# Altium project LimeSDR-QPCIe_1v2.PrjPcb (part 12 of 13)

## Sheet 28_BoardPowerSupply 2.SchDoc: Board power supply 2
size A4; Organization: Lime Microsystems; Address1: Surrey Tech Centre; Address2: Guildford GU2 7YG; Address3: Surrey; Address4: United Kingdom; Revision: v1.2; SheetNumber: 26; SheetTotal: 27
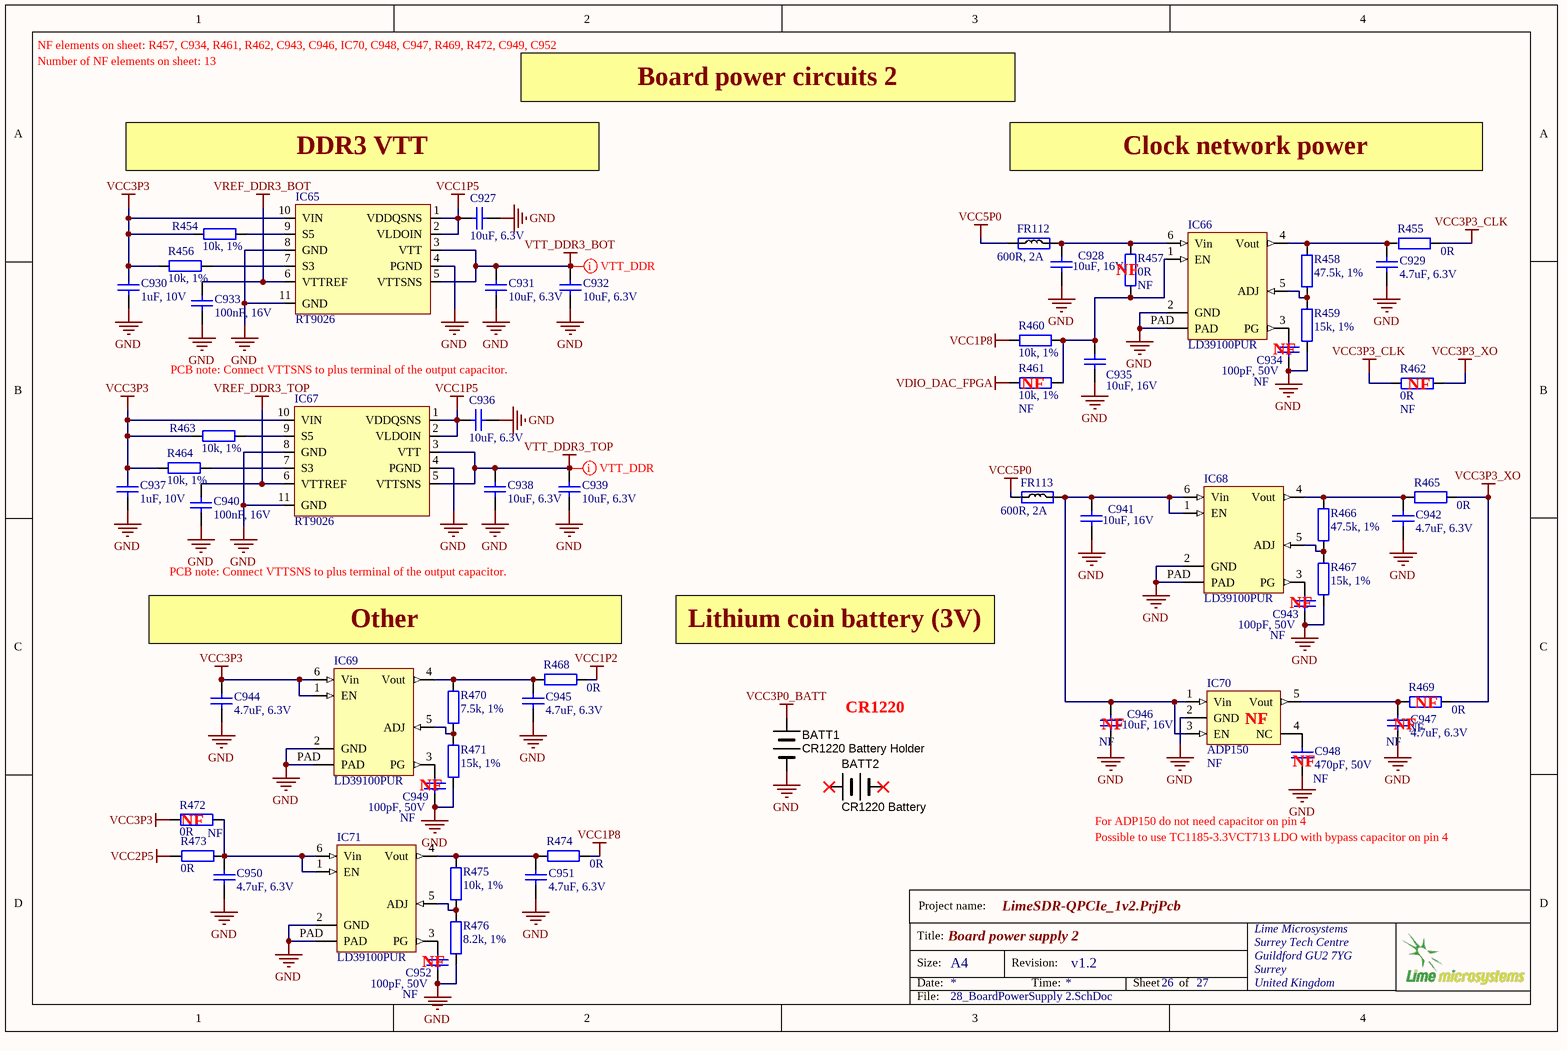
[diagram p27: 28_BoardPowerSupply 2.SchDoc]

### Parts
BATT1  CR1220 Battery Holder  [CR1220_SMD_holder]
BATT2  CR1220 Battery  (mechanical)
C927  10uF, 6.3V  [CAP0603]
C928  10uF, 16V  [CAP0603]
C929  4.7uF, 6.3V  [CAP0402]
C930  1uF, 10V  [CAP0402]
C931  10uF, 6.3V  [CAP0603]
C932  10uF, 6.3V  [CAP0603]
C933  100nF, 16V  [CAP0402]
C934  100pF, 50V  Assembly Info: NF  [CAP0402]
C935  10uF, 16V  [CAP0603]
C936  10uF, 6.3V  [CAP0603]
C937  1uF, 10V  [CAP0402]
C938  10uF, 6.3V  [CAP0603]
C939  10uF, 6.3V  [CAP0603]
C940  100nF, 16V  [CAP0402]
C941  10uF, 16V  [CAP0603]
C942  4.7uF, 6.3V  [CAP0402]
C943  100pF, 50V  Assembly Info: NF  [CAP0402]
C944  4.7uF, 6.3V  [CAP0402]
C945  4.7uF, 6.3V  [CAP0402]
C946  10uF, 16V  Assembly Info: NF  [CAP0603]
C947  4.7uF, 6.3V  Assembly Info: NF  [CAP0402]
C948  470pF, 50V  Assembly Info: NF  [CAP0402]
C949  100pF, 50V  Assembly Info: NF  [CAP0402]
C950  4.7uF, 6.3V  [CAP0402]
C951  4.7uF, 6.3V  [CAP0402]
C952  100pF, 50V  Assembly Info: NF  [CAP0402]
FR112  600R, 2A  [RES0805]
FR113  600R, 2A  [RES0805]
IC65  RT9026  [MSOP10]
IC66  LD39100PUR  [LD39100PUR]
IC67  RT9026  [MSOP10]
IC68  LD39100PUR  [LD39100PUR]
IC69  LD39100PUR  [LD39100PUR]
IC70  ADP150  Assembly Info: NF  [SOT23-5]
IC71  LD39100PUR  [LD39100PUR]
R454  10k, 1%  [RES0402]
R455  0R  [RES0402]
R456  10k, 1%  [RES0402]
R457  0R  Assembly Info: NF  [RES0805]
R458  47.5k, 1%  [RES0402]
R459  15k, 1%  [RES0402]
R460  10k, 1%  [RES0402]
R461  10k, 1%  Assembly Info: NF  [RES0402]
R462  0R  Assembly Info: NF  [RES0805]
R463  10k, 1%  [RES0402]
R464  10k, 1%  [RES0402]
R465  0R  [RES0402]
R466  47.5k, 1%  [RES0402]
R467  15k, 1%  [RES0402]
R468  0R  [RES0402]
R469  0R  Assembly Info: NF  [RES0402]
R470  7.5k, 1%  [RES0402]
R471  15k, 1%  [RES0402]
R472  0R  Assembly Info: NF  [RES0805]
R473  0R  [RES0402]
R474  0R  [RES0402]
R475  10k, 1%  [RES0402]
R476  8.2k, 1%  [RES0402]

### Nets
GND: BATT1.NEGATIVE C927.1 C928.1 C929.1 C930.1 C931.1 C932.1 C933.2 C934.1 C935.1 C936.1 C937.1 C938.1 C939.1 C940.2 C941.1 C942.1 C943.1 C944.1 C945.1 C946.1 C947.1 C948.2 C949.1 C950.1 C951.1 C952.1 IC65.4(PGND) IC65.8(GND) IC65.11(GND) IC66.2(GND) IC66.PAD IC67.4(PGND) IC67.8(GND) IC67.11(GND) IC68.2(GND) IC68.PAD IC69.2(GND) IC69.PAD IC70.2(GND) IC71.2(GND) IC71.PAD R459.1 R467.1 R471.1 R476.1
VCC1P2: R468.1
VCC1P5: C927.2 C936.2 IC65.1(VDDQSNS) IC65.2(VLDOIN) IC67.1(VDDQSNS) IC67.2(VLDOIN)
VCC1P8: R460.1 R474.1
VCC2P5: R473.2
VCC3P0_BATT: BATT1.POSITIVE
VCC3P3: C930.2 C937.2 C944.2 IC65.10(VIN) IC67.10(VIN) IC69.1(EN) IC69.6(Vin) R454.1 R456.1 R463.1 R464.1 R472.2
VCC3P3_CLK: R455.1 R462.1
VCC3P3_XO: R462.2 R465.1 R469.1
VCC5P0: FR112.1 FR113.1
VDIO_DAC_FPGA: R461.1
VREF_DDR3_BOT: C933.1 IC65.6(VTTREF)
VREF_DDR3_TOP: C940.1 IC67.6(VTTREF)
VTT_DDR3_BOT: C931.2 C932.2 IC65.3(VTT) IC65.5(VTTSNS)
VTT_DDR3_TOP: C938.2 C939.2 IC67.3(VTT) IC67.5(VTTSNS)
NetC928_2: C928.2 FR112.2 IC66.6(Vin) R457.1
NetC929_2: C929.2 IC66.4(Vout) R455.2 R458.2
NetC934_2: C934.2 IC66.3(PG)
NetC935_2: C935.2 IC66.1(EN) R457.2 R460.2 R461.2
NetC941_2: C941.2 C946.2 FR113.2 IC68.1(EN) IC68.6(Vin) IC70.1(Vin) IC70.3(EN)
NetC942_2: C942.2 IC68.4(Vout) R465.2 R466.2
NetC943_2: C943.2 IC68.3(PG)
NetC945_2: C945.2 IC69.4(Vout) R468.2 R470.2
NetC947_2: C947.2 IC70.5(Vout) R469.2
NetC948_1: C948.1 IC70.4(NC)
NetC949_2: C949.2 IC69.3(PG)
NetC950_2: C950.2 IC71.1(EN) IC71.6(Vin) R472.1 R473.1
NetC951_2: C951.2 IC71.4(Vout) R474.2 R475.2
NetC952_2: C952.2 IC71.3(PG)
NetIC65_7: IC65.7(S3) R456.2
NetIC65_9: IC65.9(S5) R454.2
NetIC66_5: IC66.5(ADJ) R458.1 R459.2
NetIC67_7: IC67.7(S3) R464.2
NetIC67_9: IC67.9(S5) R463.2
NetIC68_5: IC68.5(ADJ) R466.1 R467.2
NetIC69_5: IC69.5(ADJ) R470.1 R471.2
NetIC71_5: IC71.5(ADJ) R475.1 R476.2

Not connected (* = marked no-connect by the designer): BATT2 NEGATIVE* POSITIVE*

### Layout directives
net class VTT_DDR: VTT_DDR3_BOT, VTT_DDR3_TOP

### Notes on the sheet
- NF elements on sheet: R457, C934, R461, R462, C943, C946, IC70, C948, C947, R469, R472, C949, C952
- Number of NF elements on sheet: 13
- Board power circuits 2
- DDR3 VTT
- Clock network power
- (near R457) NF
- PCB note: Connect VTTSNS to plus terminal of the output capacitor.
- NF
- (near R461) NF
- (near R462) NF
- Other
- Lithium coin battery (3V)
- CR1220
- (near R469) NF
- (near C946) NF
- (near IC70) NF
- (near C948) NF
- (near C947) NF
- (near R472) NF
- Possible to use TC1185-3.3VCT713 LDO with bypass capacitor on pin 4
- For ADP150 do not need capacitor on pin 4
- Project name:
- Title:
- Size:
- Date:
- A4
- Revision:
- Time:
- Sheet
- of
- File:

### Library data of the parts
BATT1 = CR1220_BATTERY_HOLDER: Part Description: HOLDER COIN CELL FOR CR1220 SMD; Manufacturer: MPD (Memory Protection Devices); Manufacturer Part Number 1: BC501SM; Battery Type, Function: Coin Cell, Holder; Style: Holder (Open); Battery Cell Size: Coin, 12.0mm; Number of Cells: 1; Battery Series: 1220; Supplier 1: Digi-Key; RoHS: RoHS Compliant; Category: Battery Products; Stock 1: 17830; Pricing 1: 1=0.88, 10=0.81, 100=0.73, 500=0.68, 1000=0.59 (USD); Part Status: Active; Mounting Type: PCB, Surface Mount; Termination Style: SMD (SMT) Tab; Height Above Board: 0.157" (4.00mm); Operating Temperature: -40°C ~ 85°C; ComponentLink1URL: http://www.memoryprotectiondevices.com/datasheets/BC501SM-datasheet.pdf; ComponentLink1Description: http://www.memoryprotectiondevices.com/datasheets/BC501SM-datasheet.pdf; Supplier Part Number 1: BC501SM-ND
BATT2 = CR1220_BATTERY: Part Description: Lithium Battery Non-Rechargeable (Primary) 3V Coin, 12.5mm; Manufacturer: Panasonic - BSG; Battery Chemistry: Lithium; Battery Cell Size: Coin, 12.5mm; Voltage - Rated: 3V; Capacity: 35mAh; Discharge Rate: 100µA; Shipping Info: Due to possible restrictions, a change in ship method may be required.; Max Air Shipment Qty: 1600; Supplier 1: Digi-Key; Manufacturer Part Number 1: CR1220; RoHS: Not Applicable; Category: Battery Products; Stock 1: 19831; Pricing 1: 1=0.9, 10=0.812, 50=0.7214, 100=0.6312, 250=0.57712, 500=0.54106, 1600=0.48153, 3200=0.44651, 5000=0.43775 (USD); Part Status: Active; Size / Dimension: 0.49" Dia x 0.08" H (12.5mm x 2.0mm); Termination Style: Requires Holder; Weight: 1.2g; ComponentLink1URL: http://na.industrial.panasonic.com/sites/default/pidsa/files/crseries_datasheets_merged.pdf; ComponentLink1Description: http://na.industrial.panasonic.com/sites/default/pidsa/files/crseries_datasheets_merged.pdf; Supplier Part Number 1: P033-ND
C927 C931 C932 C936 C938 C939 = Cap_0603: Manufacturer Part Number 1: CC0603MRX5R5BB106; Part Description: 10µF ±20% 6.3V Ceramic Capacitor X5R 0603 (1608 Metric); Manufacturer: Yageo; Capacitance: 10µF; Tolerance: ±20%; Supplier 1: Digi-Key; Supplier Part Number 1: 311-1448-2-ND; Package / Case: 0603 (1608 Metric); Category: Capacitors; Voltage - Rated: 6.3V; Value: 10uF, 6.3V
C928 C935 C941 C946 = Cap_0603: Manufacturer: Yageo; Manufacturer Part Number 1: GRM188R61C106MA73D; Part Description: 10µF ±20% 16V Ceramic Capacitor X5R 0603 (1608 Metric); Temperature Coefficient: X5R; Capacitance: 10µF; Tolerance: ±20%; Value: 10uF, 16V; Supplier 1: Digi-Key; Supplier Part Number 1: 490-7201-2-ND; Category: Capacitors; Ratings: -; Features: -; Lead Style: -; Package / Case: 0603 (1608 Metric); Lead Spacing: -; Applications: General Purpose; Voltage - Rated: 16V; Operating Temperature: -55°C ~ 85°C; Thickness (Max): 0.039" (1.00mm); Mounting Type: Surface Mount, MLCC; RoHS: RoHS Compliant; Size / Dimension: 0.063" L x 0.031" W (1.60mm x 0.80mm); Packaging: Tape & Reel (TR); Height - Seated (Max): -
C929 C942 C944 C945 C947 C950 C951 = Cap_0402: Manufacturer: Murata Electronics North America; Manufacturer Part Number: GRM155R60J475ME87D; Part Description: 4.7µF ±20% 6.3V X5R Ceramic Capacitor -55°C ~ 85°C Surface Mount, MLCC 0402 (1005 Metric) 0.039" L x 0.020" W (1.00mm x 0.50mm); Tolerance: ±20%; Capacitance: 4.7µF; Temperature Coefficient: X5R; Lead Style: -; Ratings: -; Height - Seated (Max): -; Thickness (Max): 0.022" (0.55mm); Voltage - Rated: 6.3V; Packaging: Cut Tape (CT); Lead Spacing: -; Category: Capacitors; Supplier Part Number 1: 490-5408-1-ND; Applications: General Purpose; Operating Temperature: -55°C ~ 85°C; Mounting Type: Surface Mount, MLCC; Features: Derating Recommended; RoHS: RoHS Compliant; Supplier 1: Digi-Key; Package / Case: 0402 (1005 Metric); Size / Dimension: 0.039" L x 0.020" W (1.00mm x 0.50mm); Value: 4.7uF, 6.3V
C930 C937 = Cap_0402: Manufacturer Part Number 1: GRM155R61A105KE15J; Manufacturer: TDK; Part Description: 1µF ±10% 10V Ceramic Capacitor X5R 0402 (1005 Metric); Voltage Rating: 10; Capacitance Tolerance: ± 10%; Product Range: TDK - C Series; Ceramic Capacitor Case: 0402 [1005 Metric]; Capacitance: 1; Dielectric Characteristic: X6; Value: 1uF, 10V; Supplier 1: Newark; Supplier Part Number 1: 490-6298-2-ND; MSL: -; RoHS: YES
C933 C940 = Cap_0402: Manufacturer: Murata Electronics; Manufacturer Part Number: GRM155R71C104KA88D; Part Description: 0.10µF ±10% 16V Ceramic Capacitor X7R 0402 (1005 Metric); Tolerance: 10 %; Type: General Purpose MLCC; Capacitance: 0.1 uF; Case Length: 1 mm; Dielectric: X7R; Case Height: 0.5 mm; Temperature Coefficient / Code: +/- 15 %; Value: 100nF, 16V; Supplier 1: Mouser; Supplier Part Number 1: 81-GRM155R71C104KA88; Case Code - in: 0402; RoHS: RoHS Compliant; Operating Temperature Range: - 55 C to + 125 C; Series: GRM; Termination Style: SMD/SMT; Package / Case: 0402 (1005 metric); Voltage Rating DC: 16 V; Maximum Operating Temperature: + 125 C; Case Code - mm: 1005; Minimum Operating Temperature: - 55 C; Product Category: Low & Medium Capacitance SMD Ceramic Chip Capacitors; Packaging: Reel; Product: General Type MLCCs; Category: Multilayer Ceramic Capacitors MLCC - SMD/SMT; Brand: Murata Electronics; Case Width: 0.5 mm; RoHS - Mouser: Y; Standard Pack Qty: 10000; Minimum Order Quantity: 1; Reeling: True; Manufacturer Part Number 1: GRM155R71C104KA88D
C934 C943 C949 C952 = Cap_0402: Manufacturer Part Number 1: CC0402JRNPO9BN101; Manufacturer: Yageo; Part Description: 100pF ±5% 50V C0G, NP0 Ceramic Capacitor -55°C ~ 125°C Surface Mount, MLCC 0402 (1005 Metric) 0.039" L x 0.020" W (1.00mm x 0.50mm); Temperature Coefficient: C0G, NP0; Tolerance: ±5%; Value: 100pF, 50V; Supplier 1: Digi-Key; Supplier Part Number 1: 311-1024-1-ND; RoHS: RoHS Compliant; Category: Capacitors; Applications: General Purpose; Mounting Type: Surface Mount, MLCC; Capacitance: 100pF; Ratings: -; Packaging: Cut Tape (CT); Voltage - Rated: 50V; Size / Dimension: 0.039" L x 0.020" W (1.00mm x 0.50mm); Height - Seated (Max): -; Package / Case: 0402 (1005 Metric); Operating Temperature: -55°C ~ 125°C; Features: -; Lead Spacing: -; Lead Style: -; Thickness (Max): 0.022" (0.55mm)
C948 = Cap_0402: Manufacturer Part Number: C1005C0G1H471J050BA; Manufacturer: TDK Corporation; Part Description: 470pF ±5% 50V Ceramic Capacitor C0G, NP0 0402 (1005 Metric); Tolerance: ±5%; Temperature Coefficient: C0G, NP0; Value: 470pF, 50V; Supplier 1: Digi-Key; Supplier Part Number 1: 445-2656-6-ND; Ratings: -; Package / Case: 0402 (1005 Metric); Capacitance: 470pF; Packaging: Digi-Reel®; RoHS: RoHS Compliant; Lead Style: -; Thickness (Max): 0.022" (0.55mm); Size / Dimension: 0.039" L x 0.020" W (1.00mm x 0.50mm); Lead Spacing: -; Operating Temperature: -55°C ~ 125°C; Height - Seated (Max): -; Applications: General Purpose; Mounting Type: Surface Mount, MLCC; Voltage - Rated: 50V; Category: Capacitors; Features: -
FR112 FR113 = Ferrite: Manufacturer Part Number 1: MPZ2012S601A; Manufacturer: TDK; Part Description: FERRITE BEAD 600 OHM 0805 1LN; Filter Type: Differential Mode - Single; Impedance @ Frequency: 600 Ohm @ 100MHz; DC Resistance (DCR): 100 mOhm Max; DC Current Rating: 2; DC Resistance Max: 0.1; Ferrite Case Style: 0805 [2012 Metric]; Ferrite Mounting: SMD; Impedance @ 100MHz: 600; Impedance Tolerance: ± 25%; Supplier 1: Farnell; Supplier Part Number 1: 1669753RL; Mounting Type: Surface Mount; RoHS: RoHS Compliant; Height (Max): 0.041" (1.05mm); Packaging: Tape & Reel (TR); Category: Filters; Current Rating: 2A; Package / Case: 0805 (2012 Metric); Size / Dimension: 0.079" L x 0.049" W (2.00mm x 1.25mm); Value: 600R, 2A; Core Material: Ferrite; Supplier: Farnell
IC65 IC67 = RT9026: Manufacturer Part Number 1: RT9026GFP; Manufacturer: Richtek USA Inc.; Part Description: Converter, DDR Bus Termination Regulator Voltage Regulator IC 1 Output 10-MSOP-EP; Number of Outputs: 1; Voltage - Input: 3.15 V ~ 5.5 V; Supplier 1: Digi-Key; Supplier Part Number 1: 1028-1010-1-ND; Supplier Device Package: 10-MSOP-EP; Operating Temperature: -40°C ~ 85°C; Applications: Converter, DDR Bus Termination Regulator; RoHS: RoHS Compliant; Packaging: Cut Tape (CT); Mounting Type: Surface Mount; Package / Case: 10-TFSOP, 10-MSOP (0.118", 3.00mm Width) Exposed Pad; Category: Integrated Circuits (ICs)
IC66 IC68 IC69 IC71 = LD39100PUR: Manufacturer: STMicroelectronics; Part Description: Linear Voltage Regulator IC Positive Adjustable Output 0.8 V ~ 4.5 V 1A 6-DFN (3x3); Output Configuration: Positive; Output Type: Adjustable; Voltage - Input (Max): 5.5V; Voltage - Output (Min/Fixed): 0.8V; Voltage - Output (Max): 4.6V; Voltage Dropout (Max): 0.4V @ 1A; Current - Output: 1A; Current - Supply: 50µA ~ 300µA; PSRR: 70dB ~ 65dB (1kHz ~ 10kHz); Control Features: Enable, Power Good; Protection Features: Over Current, Over Temperature, Short Circuit; Supplier 1: Digi-Key; Manufacturer Part Number 1: LD39100PUR; RoHS: RoHS Compliant; Category: Integrated Circuits (ICs); Stock 1: 27970; Pricing 1: 1=0.85, 10=0.76, 100=0.5923, 500=0.48926, 1000=0.38625 (USD); Packaging: Cut Tape (CT); Part Status: Active; Operating Temperature: -40°C ~ 125°C; Mounting Type: Surface Mount; Package / Case: 6-VDFN Exposed Pad; Supplier Device Package: 6-DFN (3x3); ComponentLink1URL: http://www.st.com/content/ccc/resource/technical/document/datasheet/72/02/e5/ee/df/36/40/5e/CD00233788.pdf/files/CD00233788.pdf/jcr:content/translations/en.CD00233788.pdf; ComponentLink1Description: http://www.st.com/content/ccc/resource/technical/document/datasheet/72/02/e5/ee/df/36/40/5e/CD00233788.pdf/files/CD00233788.pdf/jcr:content/translations/en.CD00233788.pdf; Supplier Part Number 1: 497-11013-1-ND
IC70 = ADP150: Part Description: IC REG LDO 3.3V 0.15A TSOT23-5; Manufacturer: Analog Devices Inc.; Manufacturer Part Number 1: ADP150AUJZ-3.3-R7; Regulator Topology: Positive Fixed; Voltage - Output: 3.3V; Current - Output: 150mA; Voltage - Dropout (Typical): 0.105V @ 150mA; Voltage - Input: Up to 5.5V; Current - Limit (Min): 190mA; Supplier 1: Digi-Key; RoHS: RoHS Compliant; Category: Integrated Circuits (ICs); Stock 1: 10229; Pricing 1: 1=1.09, 10=0.972, 100=0.7581, 500=0.62624, 1000=0.4944 (USD); Packaging: Cut Tape (CT); Part Status: Active; Operating Temperature: -40°C ~ 125°C; Mounting Type: Surface Mount; Package / Case: SOT-23-5 Thin, TSOT-23-5; Supplier Device Package: TSOT-5; ComponentLink1URL: http://www.analog.com/media/en/technical-documentation/data-sheets/ADP150.pdf; ComponentLink1Description: http://www.analog.com/media/en/technical-documentation/data-sheets/ADP150.pdf; Supplier Part Number 1: ADP150AUJZ-3.3-R7CT-ND
R454 R456 R460 R461 R463 R464 R475 = Res_0402: Manufacturer: Yageo; Manufacturer Part Number 1: RC0402FR-0710KL; Part Description: RES SMD 10K OHM 1% 1/16W 0402; Temperature Coefficient: ±100ppm/°C; Power (Watts): 0.063W, 1/16W; Value: 10k, 1%; Supplier 1: Digi-Key; Supplier Part Number 1: 311-10.0KLRTR-ND; Resistance (Ohms): 10k; Packaging: Tape & Reel (TR); RoHS: RoHS Compliant; Package / Case: 0402 (1005 Metric); Tolerance: ±1%; Operating Temperature: -55°C ~ 155°C; Size / Dimension: 0.039" L x 0.020" W (1.00mm x 0.50mm); Number of Terminations: 2; Category: Resistors; Height: 0.016" (0.40mm); Supplier Device Package: 0402; Features: Moisture Resistant; Composition: Thick Film
R455 R465 R468 R469 R473 R474 = Res_0402: as R419-R423 on sheet 27_BoardPowerSupply 1; Value: 0R; Supplier 1: Digi-Key; Supplier Part Number 1: 311-0.0JRTR-ND; Category: Resistors; Temperature Coefficient: -; Features: Moisture Resistant; Supplier Device Package: 0402; Height: 0.016" (0.40mm); Package / Case: 0402 (1005 Metric); Operating Temperature: -55°C ~ 155°C; Size / Dimension: 0.039" L x 0.020" W (1.00mm x 0.50mm); Composition: Thick Film; Packaging: Tape & Reel (TR); Number of Terminations: 2; RoHS: RoHS Compliant
R457 R462 R472 = Res_0402: Manufacturer Part Number 1: CRCW08050000Z0EA; Manufacturer: Vishay Dale; Part Description: RES SMD 0.0 OHM JUMPER 1/8W 0805; Power (Watts): 0.125W, 1/8W; Resistance (Ohms): 0.0; Tolerance: Jumper; Value: 0R; Supplier 1: Digi-Key; Supplier Part Number 1: 541-0.0ATR-ND; Package / Case: 0805 (2012 Metric); Height: 0.020" (0.50mm); Packaging: Tape & Reel (TR); Operating Temperature: -55°C ~ 155°C; Temperature Coefficient: -; RoHS: RoHS Compliant; Size / Dimension: 0.079" L x 0.049" W (2.00mm x 1.25mm); Supplier Device Package: 0805 (2012 Metric); Number of Terminations: 2; Category: Resistors; Features: Automotive AEC-Q200; Composition: Thick Film
R458 R466 = Res_0402: Manufacturer Part Number: ERJ-2RKF4752X; Manufacturer: Panasonic Electronic Components; Part Description: RES SMD 47.5K OHM 1% 1/10W 0402; Temperature Coefficient: ±100ppm/°C; Power (Watts): 0.1W, 1/10W; Value: 47.5k, 1%; Height: 0.016" (0.40mm); Supplier 1: Digi-Key; Features: Automotive AEC-Q200; Packaging: Cut Tape (CT); Composition: Thick Film; Number of Terminations: 2; Supplier Device Package: 0402; Category: Resistors; Package / Case: 0402 (1005 Metric); Supplier Part Number 1: P47.5KLCT-ND; Size / Dimension: 0.039" L x 0.020" W (1.00mm x 0.50mm); Resistance (Ohms): 47.5k; Operating Temperature: -55°C ~ 155°C; Tolerance: ±1%; RoHS: RoHS Compliant
R459 R467 R471 = Res_0402: Manufacturer: Yageo; Manufacturer Part Number 1: RC0402FR-0715KL; Part Description: RES SMD 15K OHM 1% 1/16W 0402; Temperature Coefficient: ±100ppm/°C; Power (Watts): 0.063W, 1/16W; Value: 15k, 1%; Category: Resistors; Number of Terminations: 2; RoHS: RoHS Compliant; Features: Moisture Resistant; Operating Temperature: -55°C ~ 155°C; Tolerance: ±1%; Composition: Thick Film; Resistance (Ohms): 15k; Failure Rate: -; Height - Seated (Max): 0.016" (0.40mm); Packaging: Cut Tape (CT); Supplier Device Package: 0402; Size / Dimension: 0.039" L x 0.020" W (1.00mm x 0.50mm); Package / Case: 0402 (1005 Metric); Part Status: Active; Supplier 1: Digi-Key; Supplier Part Number 1: 311-15.0KLRCT-ND
R470 = Res_0402: Manufacturer: Yageo; Manufacturer Part Number: RC0402FR-077K5L; Part Description: ±1% 0.063W, 1/16W Chip Resistor 0402 (1005 Metric) Automotive AEC-Q200, Moisture Resistant Thick Film; Power (Watts): 0.063W, 1/16W; Temperature Coefficient: ±100ppm/°C; Value: 7.5k, 1%; Operating Temperature: -55°C ~ 155°C; Height - Seated (Max): 0.016" (0.40mm); Supplier 1: Digi-Key; Composition: Thick Film; Packaging: Cut Tape (CT); Tolerance: ±1%; Category: Resistors; Part Status: Active; Failure Rate: -; Supplier Device Package: 0402; Features: Moisture Resistant; Supplier Part Number 1: YAG3512CT-ND; RoHS: RoHS Compliant; Package / Case: 0402 (1005 Metric); Size / Dimension: 0.039" L x 0.020" W (1.00mm x 0.50mm)
R476 = Res_0402: Manufacturer: Yageo; Part Description: RES SMD 8.2K OHM 1% 1/16W 0402; Manufacturer Part Number 1: RC0402FR-078K2L; Power (Watts): 0.063W, 1/16W; Temperature Coefficient: ±100ppm/°C; Value: 8.2k, 1%; Supplier 1: Digi-Key; Supplier Device Package: 0402; Package / Case: 0402 (1005 Metric); Height: 0.016" (0.40mm); Supplier Part Number 1: 311-8.20KLRCT-ND; Number of Terminations: 2; Operating Temperature: -55°C ~ 155°C; Resistance (Ohms): 8.2k; Size / Dimension: 0.039" L x 0.020" W (1.00mm x 0.50mm); Composition: Thick Film; Category: Resistors; Tolerance: ±1%; Features: Moisture Resistant; RoHS: RoHS Compliant; Packaging: Cut Tape (CT)

## Sheet 29_LMS7002M_PowerSupply.SchDoc: LMS7002M power supply
size A3; Organization: Lime Microsystems; Address1: Surrey Tech Centre; Address2: Guildford GU2 7YG; Address3: Surrey; Address4: United Kingdom; Revision: v1.2; SheetNumber: 27; SheetTotal: 27
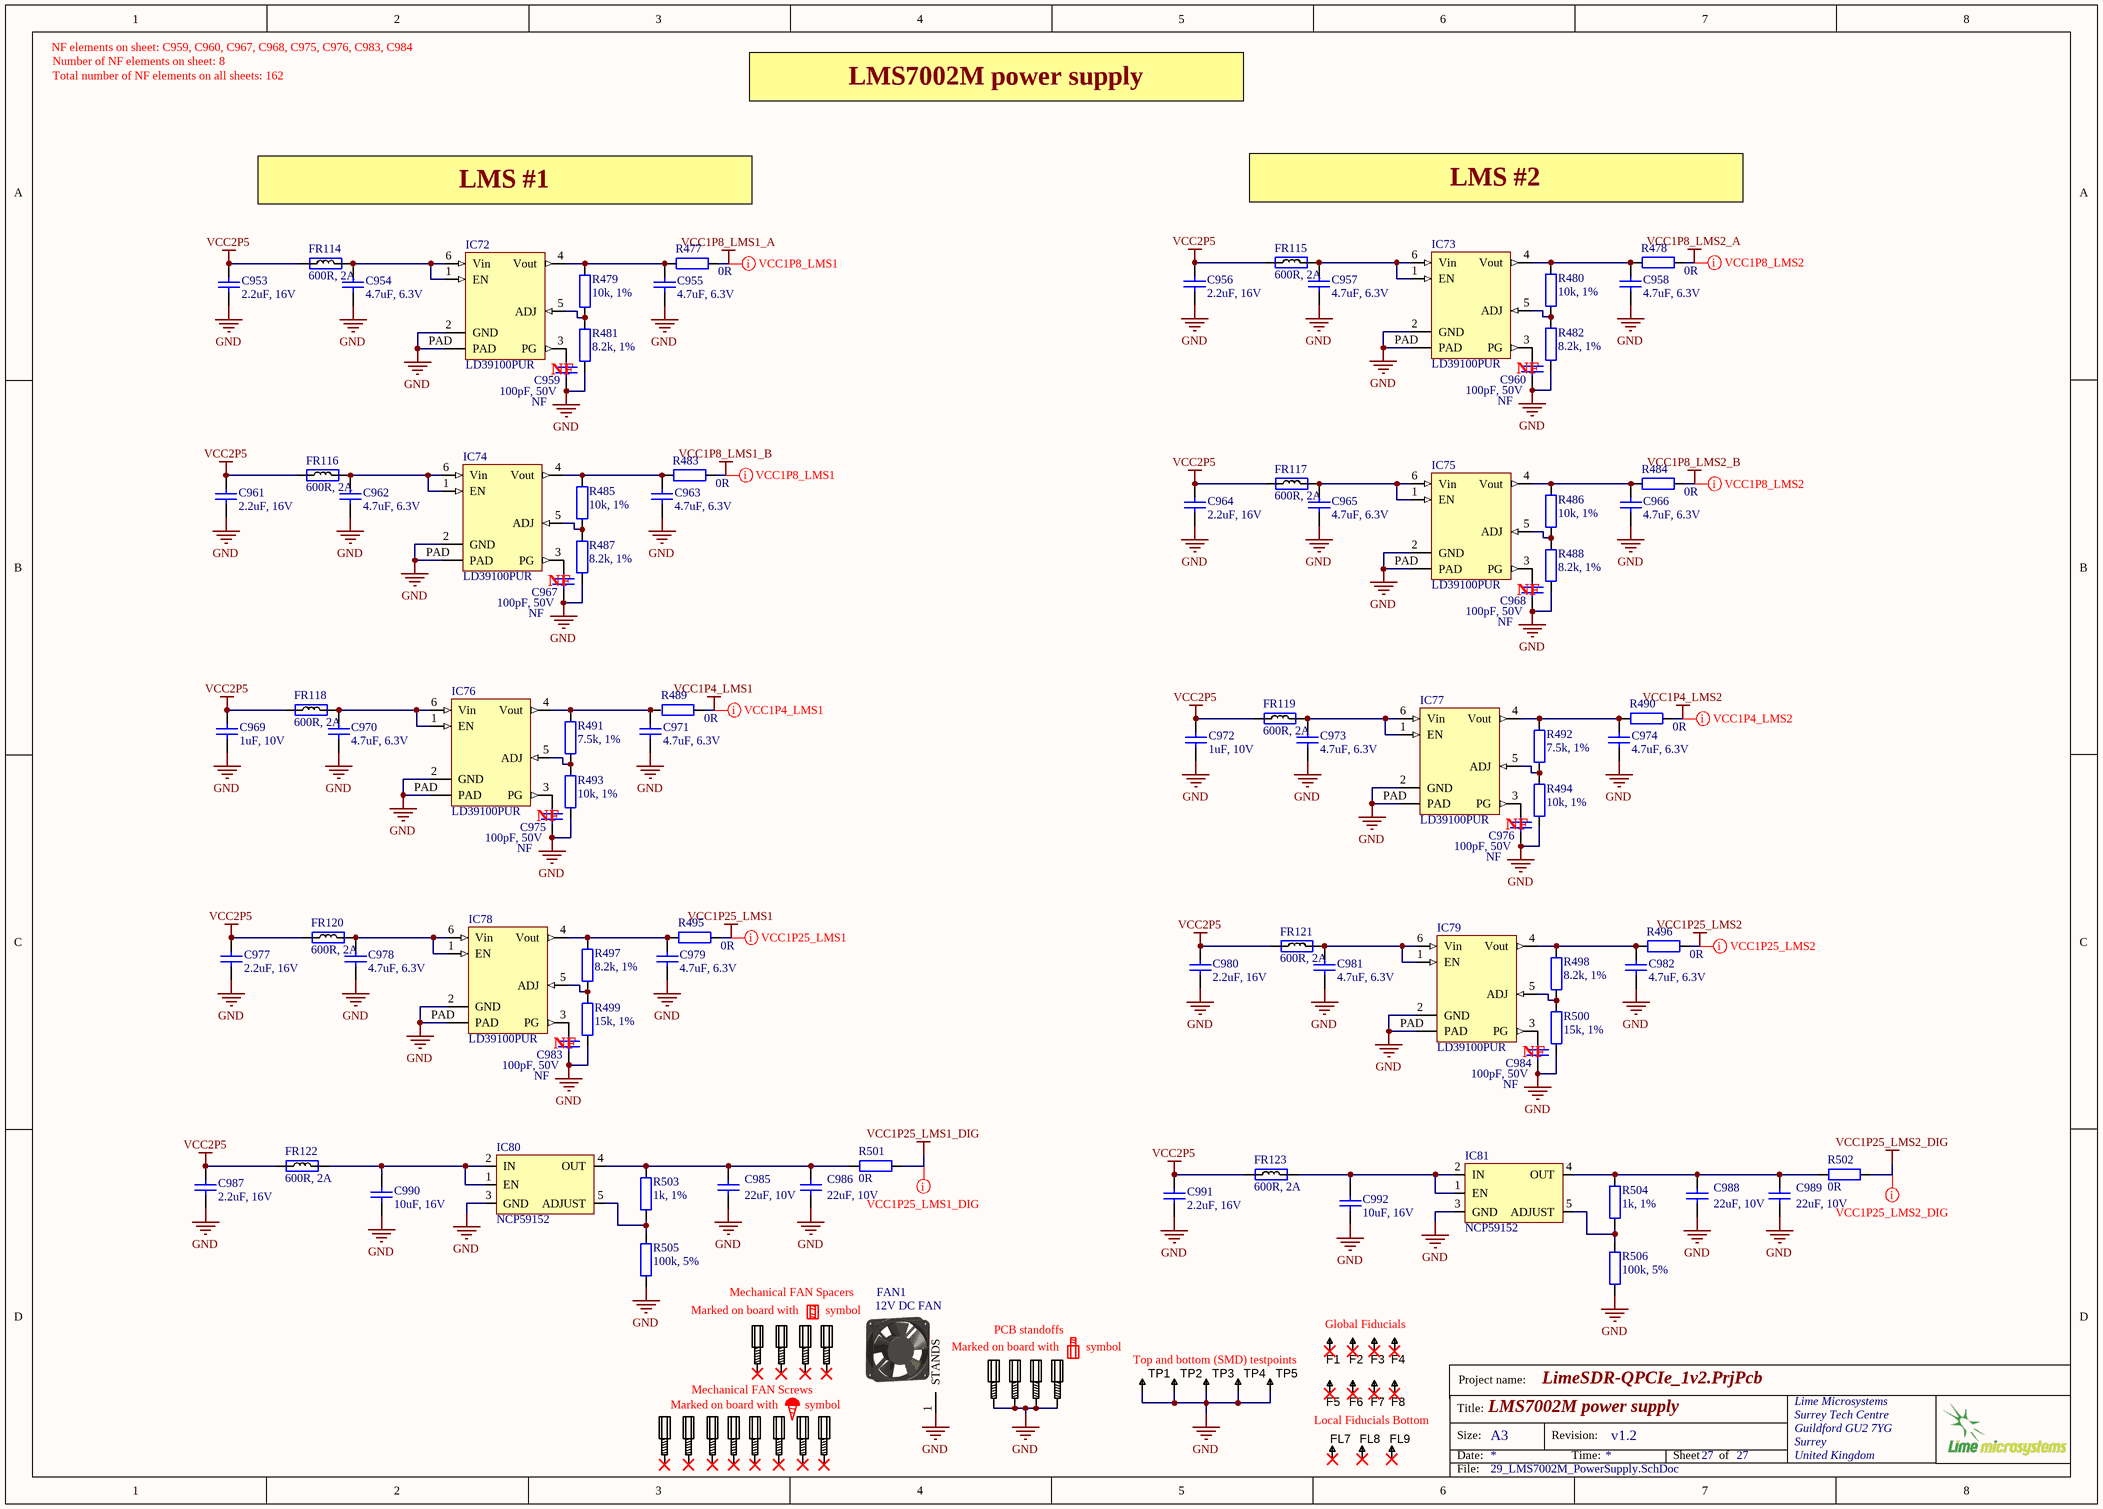
[diagram p28: 29_LMS7002M_PowerSupply.SchDoc]

### Parts
C953  2.2uF, 16V  [CAP0402]
C954  4.7uF, 6.3V  [CAP0402]
C955  4.7uF, 6.3V  [CAP0402]
C956  2.2uF, 16V  [CAP0402]
C957  4.7uF, 6.3V  [CAP0402]
C958  4.7uF, 6.3V  [CAP0402]
C959  100pF, 50V  Assembly Info: NF  [CAP0402]
C960  100pF, 50V  Assembly Info: NF  [CAP0402]
C961  2.2uF, 16V  [CAP0402]
C962  4.7uF, 6.3V  [CAP0402]
C963  4.7uF, 6.3V  [CAP0402]
C964  2.2uF, 16V  [CAP0402]
C965  4.7uF, 6.3V  [CAP0402]
C966  4.7uF, 6.3V  [CAP0402]
C967  100pF, 50V  Assembly Info: NF  [CAP0402]
C968  100pF, 50V  Assembly Info: NF  [CAP0402]
C969  1uF, 10V  [CAP0402]
C970  4.7uF, 6.3V  [CAP0402]
C971  4.7uF, 6.3V  [CAP0402]
C972  1uF, 10V  [CAP0402]
C973  4.7uF, 6.3V  [CAP0402]
C974  4.7uF, 6.3V  [CAP0402]
C975  100pF, 50V  Assembly Info: NF  [CAP0402]
C976  100pF, 50V  Assembly Info: NF  [CAP0402]
C977  2.2uF, 16V  [CAP0402]
C978  4.7uF, 6.3V  [CAP0402]
C979  4.7uF, 6.3V  [CAP0402]
C980  2.2uF, 16V  [CAP0402]
C981  4.7uF, 6.3V  [CAP0402]
C982  4.7uF, 6.3V  [CAP0402]
C983  100pF, 50V  Assembly Info: NF  [CAP0402]
C984  100pF, 50V  Assembly Info: NF  [CAP0402]
C985  22uF, 10V  [CAP0603]
C986  22uF, 10V  [CAP0603]
C987  2.2uF, 16V  [CAP0402]
C988  22uF, 10V  [CAP0603]
C989  22uF, 10V  [CAP0603]
C990  10uF, 16V  [CAP0603]
C991  2.2uF, 16V  [CAP0402]
C992  10uF, 16V  [CAP0603]
F1  Fiducial  [Fiducial]  (value not drawn)
F2  Fiducial  [Fiducial]  (value not drawn)
F3  Fiducial  [Fiducial]  (value not drawn)
F4  Fiducial  [Fiducial]  (value not drawn)
F5  Fiducial  [Fiducial]  (value not drawn)
F6  Fiducial  [Fiducial]  (value not drawn)
F7  Fiducial  [Fiducial]  (value not drawn)
F8  Fiducial  [Fiducial]  (value not drawn)
FAN1  12V DC FAN  [FAN_60mm_v3]
FL7  Fiducial  [Fiducial_local]  (value not drawn)
FL8  Fiducial  [Fiducial_local]  (value not drawn)
FL9  Fiducial  [Fiducial_local]  (value not drawn)
FR114  600R, 2A  [RES0805]
FR115  600R, 2A  [RES0805]
FR116  600R, 2A  [RES0805]
FR117  600R, 2A  [RES0805]
FR118  600R, 2A  [RES0805]
FR119  600R, 2A  [RES0805]
FR120  600R, 2A  [RES0805]
FR121  600R, 2A  [RES0805]
FR122  600R, 2A  [RES0805]
FR123  600R, 2A  [RES0805]
IC72  LD39100PUR  [LD39100PUR]
IC73  LD39100PUR  [LD39100PUR]
IC74  LD39100PUR  [LD39100PUR]
IC75  LD39100PUR  [LD39100PUR]
IC76  LD39100PUR  [LD39100PUR]
IC77  LD39100PUR  [LD39100PUR]
IC78  LD39100PUR  [LD39100PUR]
IC79  LD39100PUR  [LD39100PUR]
IC80  NCP59152  [TO-263-5]
IC81  NCP59152  [TO-263-5]
MECH22  Spacer M3  (value not drawn)  (mechanical)
MECH23  Spacer M3  (value not drawn)  (mechanical)
MECH24  Spacer M3  (value not drawn)  (mechanical)
MECH25  Spacer M3  (value not drawn)  (mechanical)
MECH26  # pcs.  [PCB_standoff]  (value not drawn)
MECH27  # pcs.  [PCB_standoff]  (value not drawn)
MECH28  Screws M3  (value not drawn)  (mechanical)
MECH29  Screws M3  (value not drawn)  (mechanical)
MECH30  Screws M3  (value not drawn)  (mechanical)
MECH31  Screws M3  (value not drawn)  (mechanical)
MECH32  Screws M3  (value not drawn)  (mechanical)
MECH33  Screws M3  (value not drawn)  (mechanical)
MECH34  Screws M3  (value not drawn)  (mechanical)
MECH35  Screws M3  (value not drawn)  (mechanical)
MECH36  # pcs.  [PCB_standoff]  (value not drawn)
MECH37  # pcs.  [PCB_standoff]  (value not drawn)
R477  0R  [RES0402]
R478  0R  [RES0402]
R479  10k, 1%  [RES0402]
R480  10k, 1%  [RES0402]
R481  8.2k, 1%  [RES0402]
R482  8.2k, 1%  [RES0402]
R483  0R  [RES0402]
R484  0R  [RES0402]
R485  10k, 1%  [RES0402]
R486  10k, 1%  [RES0402]
R487  8.2k, 1%  [RES0402]
R488  8.2k, 1%  [RES0402]
R489  0R  [RES0402]
R490  0R  [RES0402]
R491  7.5k, 1%  [RES0402]
R492  7.5k, 1%  [RES0402]
R493  10k, 1%  [RES0402]
R494  10k, 1%  [RES0402]
R495  0R  [RES0402]
R496  0R  [RES0402]
R497  8.2k, 1%  [RES0402]
R498  8.2k, 1%  [RES0402]
R499  15k, 1%  [RES0402]
R500  15k, 1%  [RES0402]
R501  0R  [RES0402]
R502  0R  [RES0402]
R503  1k, 1%  [RES0402]
R504  1k, 1%  [RES0402]
R505  100k, 5%  [RES0402]
R506  100k, 5%  [RES0402]
TP1  TESTPOINT_THT_MINI  [TP-SMD-LOW_PROFILE]  (value not drawn)
TP2  TESTPOINT_THT_MINI  [TP-SMD-LOW_PROFILE]  (value not drawn)
TP3  TESTPOINT_THT_MINI  [TP-SMD-LOW_PROFILE]  (value not drawn)
TP4  TESTPOINT_THT_MINI  [TP-SMD-LOW_PROFILE]  (value not drawn)
TP5  TESTPOINT_THT_MINI  [TP-SMD-LOW_PROFILE]  (value not drawn)

### Nets
GND: C953.1 C954.1 C955.1 C956.1 C957.1 C958.1 C959.1 C960.1 C961.1 C962.1 C963.1 C964.1 C965.1 C966.1 C967.1 C968.1 C969.1 C970.1 C971.1 C972.1 C973.1 C974.1 C975.1 C976.1 C977.1 C978.1 C979.1 C980.1 C981.1 C982.1 C983.1 C984.1 C985.1 C986.1 C987.1 C988.1 C989.1 C990.1 C991.1 C992.1 FAN1.1(STANDS) IC72.2(GND) IC72.PAD IC73.2(GND) IC73.PAD IC74.2(GND) IC74.PAD IC75.2(GND) IC75.PAD IC76.2(GND) IC76.PAD IC77.2(GND) IC77.PAD IC78.2(GND) IC78.PAD IC79.2(GND) IC79.PAD IC80.3(GND) IC81.3(GND) MECH26.MH1 MECH27.MH1 MECH36.MH1 MECH37.MH1 R481.1 R482.1 R487.1 R488.1 R493.1 R494.1 R499.1 R500.1 R505.2 R506.2 TP1.1 TP2.1 TP3.1 TP4.1 TP5.1
VCC1P4_LMS1: R489.1
VCC1P4_LMS2: R490.1
VCC1P8_LMS1_A: R477.1
VCC1P8_LMS1_B: R483.1
VCC1P8_LMS2_A: R478.1
VCC1P8_LMS2_B: R484.1
VCC1P25_LMS1: R495.1
VCC1P25_LMS1_DIG: R501.1
VCC1P25_LMS2: R496.1
VCC1P25_LMS2_DIG: R502.1
VCC2P5: C953.2 C956.2 C961.2 C964.2 C969.2 C972.2 C977.2 C980.2 C987.2 C991.2 FR114.1 FR115.1 FR116.1 FR117.1 FR118.1 FR119.1 FR120.1 FR121.1 FR122.1 FR123.1
NetC954_2: C954.2 FR114.2 IC72.1(EN) IC72.6(Vin)
NetC955_2: C955.2 IC72.4(Vout) R477.2 R479.2
NetC957_2: C957.2 FR115.2 IC73.1(EN) IC73.6(Vin)
NetC958_2: C958.2 IC73.4(Vout) R478.2 R480.2
NetC959_2: C959.2 IC72.3(PG)
NetC960_2: C960.2 IC73.3(PG)
NetC962_2: C962.2 FR116.2 IC74.1(EN) IC74.6(Vin)
NetC963_2: C963.2 IC74.4(Vout) R483.2 R485.2
NetC965_2: C965.2 FR117.2 IC75.1(EN) IC75.6(Vin)
NetC966_2: C966.2 IC75.4(Vout) R484.2 R486.2
NetC967_2: C967.2 IC74.3(PG)
NetC968_2: C968.2 IC75.3(PG)
NetC970_2: C970.2 FR118.2 IC76.1(EN) IC76.6(Vin)
NetC971_2: C971.2 IC76.4(Vout) R489.2 R491.2
NetC973_2: C973.2 FR119.2 IC77.1(EN) IC77.6(Vin)
NetC974_2: C974.2 IC77.4(Vout) R490.2 R492.2
NetC975_2: C975.2 IC76.3(PG)
NetC976_2: C976.2 IC77.3(PG)
NetC978_2: C978.2 FR120.2 IC78.1(EN) IC78.6(Vin)
NetC979_2: C979.2 IC78.4(Vout) R495.2 R497.2
NetC981_2: C981.2 FR121.2 IC79.1(EN) IC79.6(Vin)
NetC982_2: C982.2 IC79.4(Vout) R496.2 R498.2
NetC983_2: C983.2 IC78.3(PG)
NetC984_2: C984.2 IC79.3(PG)
NetC985_2: C985.2 C986.2 IC80.4(OUT) R501.2 R503.2
NetC988_2: C988.2 C989.2 IC81.4(OUT) R502.2 R504.2
NetC990_2: C990.2 FR122.2 IC80.1(EN) IC80.2(IN)
NetC992_2: C992.2 FR123.2 IC81.1(EN) IC81.2(IN)
NetIC72_5: IC72.5(ADJ) R479.1 R481.2
NetIC73_5: IC73.5(ADJ) R480.1 R482.2
NetIC74_5: IC74.5(ADJ) R485.1 R487.2
NetIC75_5: IC75.5(ADJ) R486.1 R488.2
NetIC76_5: IC76.5(ADJ) R491.1 R493.2
NetIC77_5: IC77.5(ADJ) R492.1 R494.2
NetIC78_5: IC78.5(ADJ) R497.1 R499.2
NetIC79_5: IC79.5(ADJ) R498.1 R500.2
NetIC80_5: IC80.5(ADJUST) R503.1 R505.1
NetIC81_5: IC81.5(ADJUST) R504.1 R506.1

Not connected (* = marked no-connect by the designer): F1 1*; F2 1*; F3 1*; F4 1*; F5 1*; F6 1*; F7 1*; F8 1*; FL7 1*; FL8 1*; FL9 1*; MECH22 MH1*; MECH23 MH1*; MECH24 MH1*; MECH25 MH1*; MECH28 MH1*; MECH29 MH1*; MECH30 MH1*; MECH31 MH1*; MECH32 MH1*; MECH33 MH1*; MECH34 MH1*; MECH35 MH1*

### Layout directives
net class VCC1P8_LMS1: VCC1P8_LMS1_A, VCC1P8_LMS1_B
net class VCC1P4_LMS1: VCC1P4_LMS1
net class VCC1P25_LMS1: VCC1P25_LMS1
net class VCC1P25_LMS1_DIG: VCC1P25_LMS1_DIG
net class VCC1P8_LMS2: VCC1P8_LMS2_A, VCC1P8_LMS2_B
net class VCC1P4_LMS2: VCC1P4_LMS2
net class VCC1P25_LMS2: VCC1P25_LMS2
net class VCC1P25_LMS2_DIG: VCC1P25_LMS2_DIG

### Notes on the sheet
- NF elements on sheet: C959, C960, C967, C968, C975, C976, C983, C984
- Number of NF elements on sheet: 8
- Total number of NF elements on all sheets: 162
- LMS7002M power supply
- LMS #1
- LMS #2
- NF
- Marked on board with         symbol
- Mechanical FAN Spacers
- Global Fiducials
- Mechanical FAN Screws
- PCB standoffs
- Top and bottom (SMD) testpoints
- Local Fiducials Bottom
- Project name:
- Title:
- Size:
- Date:
- A3
- Revision:
- Time:
- Sheet
- of
- File:

### Library data of the parts
C953 C956 C961 C964 C977 C980 C987 C991 = Cap_0402: CAP CER 2.2UF 16V 10% X5R 0402; Manufacturer Part Number 1: C1005X5R1C225K050BC; Manufacturer: TDK Corporation; Part Description: 2.2µF ±10% 16V Ceramic Capacitor X5R 0402 (1005 Metric); Capacitance: 2.2µF; Tolerance: ±20%; Capacitor Case Style: 0402 [1005 Metric]; Value: 2.2uF, 16V; Supplier 1: Digi-Key; Supplier Part Number 1: 445-9085-6-ND; Category: Capacitors; Voltage - Rated: 16V; Thickness (Max): 0.022" (0.55mm); Applications: General Purpose; Package / Case: 0402 (1005 Metric); Size / Dimension: 0.039" L x 0.020" W (1.00mm x 0.50mm); Features: -; Temperature Coefficient: X5R; Mounting Type: Surface Mount, MLCC; Ratings: -; Lead Style: -; Operating Temperature: -55°C ~ 85°C; Lead Spacing: -; RoHS: RoHS Compliant; Height - Seated (Max): -; Packaging: Tape & Reel (TR); Operating Temperature Range: -55°C to +85
C954 C955 C957 C958 C962 C963 C965 C966 C970 C971 C973 C974 C978 C979 C981 C982 = Cap_0402: as C929 on sheet 28_BoardPowerSupply 2; Lead Style: -; Ratings: -; Height - Seated (Max): -; Thickness (Max): 0.022" (0.55mm); Voltage - Rated: 6.3V; Packaging: Cut Tape (CT); Lead Spacing: -; Category: Capacitors; Supplier Part Number 1: 490-5408-1-ND; Applications: General Purpose; Operating Temperature: -55°C ~ 85°C; Mounting Type: Surface Mount, MLCC; Features: Derating Recommended; RoHS: RoHS Compliant; Supplier 1: Digi-Key; Package / Case: 0402 (1005 Metric); Size / Dimension: 0.039" L x 0.020" W (1.00mm x 0.50mm); Value: 4.7uF, 6.3V
C959 C960 C967 C968 C975 C976 C983 C984 = Cap_0402: as C934 on sheet 28_BoardPowerSupply 2; Value: 100pF, 50V; Supplier 1: Digi-Key; Supplier Part Number 1: 311-1024-1-ND; RoHS: RoHS Compliant; Category: Capacitors; Applications: General Purpose; Mounting Type: Surface Mount, MLCC; Capacitance: 100pF; Ratings: -; Packaging: Cut Tape (CT); Voltage - Rated: 50V; Size / Dimension: 0.039" L x 0.020" W (1.00mm x 0.50mm); Height - Seated (Max): -; Package / Case: 0402 (1005 Metric); Operating Temperature: -55°C ~ 125°C; Features: -; Lead Spacing: -; Lead Style: -; Thickness (Max): 0.022" (0.55mm)
C969 C972 = Cap_0402: as C930 on sheet 28_BoardPowerSupply 2; Value: 1uF, 10V; Supplier 1: Newark; Supplier Part Number 1: 490-6298-2-ND; MSL: -; RoHS: YES
C985 C986 C988 C989 = Cap_0603: Manufacturer Part Number 1: C1608X5R1A226M080AC; Part Description: 22µF ±20% 10V Ceramic Capacitor X5R 0603 (1608 Metric); Manufacturer: TDK Corporation; Brand: TDK; Temperature Coefficient / Code: +/- 15 %; Tolerance: 20 %; Type: Multilayer Ceramic Chip Capacitor; Supplier 1: Mouser; Supplier Part Number 1: 810-C1608X5R1A226M; Package / Case: 0603 (1608 metric); Category: Multilayer Ceramic Capacitors MLCC - SMD/SMT; Capacitance: 22 uF; Operating Temperature Range: - 55 C to + 85 C; Case Code - in: 0603; Voltage Rating DC: 10 V; Case Code - mm: 1608; Value: 22uF, 10V
C990 C992 = Cap_0603: as C928 on sheet 28_BoardPowerSupply 2; Value: 10uF, 16V; Supplier 1: Digi-Key; Supplier Part Number 1: 490-7201-2-ND; Category: Capacitors; Ratings: -; Features: -; Lead Style: -; Package / Case: 0603 (1608 Metric); Lead Spacing: -; Applications: General Purpose; Voltage - Rated: 16V; Operating Temperature: -55°C ~ 85°C; Thickness (Max): 0.039" (1.00mm); Mounting Type: Surface Mount, MLCC; RoHS: RoHS Compliant; Size / Dimension: 0.063" L x 0.031" W (1.60mm x 0.80mm); Packaging: Tape & Reel (TR); Height - Seated (Max): -
FAN1 = 12V_DC_FAN: Part Description: DC Fans DC FAN 60x20mm 12VDC Sleeve WIRE; Manufacturer: Sunon Fans; Manufacturer Part Number 1: HA60151V4-1000U-A99; .Checked PCB: AV; Voltage - Rated: 12VDC; Air Flow: 12.7 CFM (0.360m³/min); Static Pressure: 0.040 in H2O (10.0 Pa); Bearing Type: Vapo-Bearing™; Fan Type: Tubeaxial; Noise: 14.5 dB(A); Power (Watts): 0.270W; RPM: 2200 RPM; Current Rating: 0.022A; Supplier 1: Digi-Key; Supplier Part Number 1: 259-1792-ND; RoHS: RoHS Compliant; Category: Fans, Thermal Management; Stock 1: 459; Pricing 1: 1=7.66, 10=7.022, 25=6.3832, 50=5.9044, 100=5.2661, 250=5.02676, 500=4.70762, 1000=4.38845 (USD); Part Status: Active; Size / Dimension: Square - 60mm L x 60mm H; Width: 15.00mm; Features: Auto Restart; Termination: 2 Wire Leads; Ingress Protection: -; Operating Temperature: -; Approvals: -; Weight: 0.077 lb (34.93g); Voltage Range: -; Material - Frame: -; Material - Blade: -; ComponentLink1URL: http://www.sunon.com/uFiles/file/03_products/08-catalog%20download/Sunon%20DC%20Brushless%20Fan%20&%20Blower_(240-E).pdf; ComponentLink1Description: http://www.sunon.com/uFiles/file/03_products/08-catalog%20download/Sunon%20DC%20Brushless%20Fan%20&%20Blower_(240-E).pdf
FR114-FR123 = Ferrite: as FR112 on sheet 28_BoardPowerSupply 2; Supplier 1: Farnell; Supplier Part Number 1: 1669753RL; Mounting Type: Surface Mount; RoHS: RoHS Compliant; Height (Max): 0.041" (1.05mm); Packaging: Tape & Reel (TR); Category: Filters; Current Rating: 2A; Package / Case: 0805 (2012 Metric); Size / Dimension: 0.079" L x 0.049" W (2.00mm x 1.25mm); Value: 600R, 2A; Core Material: Ferrite; Supplier: Farnell
IC72-IC79 = LD39100PUR: as IC66 on sheet 28_BoardPowerSupply 2; Supplier 1: Digi-Key; Manufacturer Part Number 1: LD39100PUR; RoHS: RoHS Compliant; Category: Integrated Circuits (ICs); Stock 1: 27970; Pricing 1: 1=0.85, 10=0.76, 100=0.5923, 500=0.48926, 1000=0.38625 (USD); Packaging: Cut Tape (CT); Part Status: Active; Operating Temperature: -40°C ~ 125°C; Mounting Type: Surface Mount; Package / Case: 6-VDFN Exposed Pad; Supplier Device Package: 6-DFN (3x3); ComponentLink1URL: http://www.st.com/content/ccc/resource/technical/document/datasheet/72/02/e5/ee/df/36/40/5e/CD00233788.pdf/files/CD00233788.pdf/jcr:content/translations/en.CD00233788.pdf; ComponentLink1Description: http://www.st.com/content/ccc/resource/technical/document/datasheet/72/02/e5/ee/df/36/40/5e/CD00233788.pdf/files/CD00233788.pdf/jcr:content/translations/en.CD00233788.pdf; Supplier Part Number 1: 497-11013-1-ND
IC80 IC81 = NCP59151: Manufacturer Part Number: NCP59152DSADJR4G; Manufacturer: ON Semiconductor; Part Description: Linear Voltage Regulator IC Positive Adjustable 1 Output Adj to 1.24V 1.5A D2PAK-5; Number of Regulators: 1; Regulator Topology: Positive Adjustable; Voltage - Output: Adj to 1.24V; Voltage - Dropout (Typical): 0.3V @ 1.5A; Voltage - Input: 2.24 V ~ 13.5 V; Current - Output: 1.5A; Category: Integrated Circuits (ICs); Supplier Device Package: D2PAK-5; Operating Temperature: -40°C ~ 125°C; Current - Limit (Min): -; Mounting Type: Surface Mount; Package / Case: TO-263-6, D²Pak (5 Leads + Tab), TO-263BA; Supplier 1: Digi-Key; RoHS: RoHS Compliant; Packaging: Cut Tape (CT); Part Status: Active; Supplier Part Number 1: NCP59152DSADJR4GOSCT-ND
MECH22-MECH25 = STANDOFF_M-F_THREADED_M3x8x10mm_HEX_5mm dia: STANDOFF M/F MET 5MM HEX 10MM L; Manufacturer: BOSSARD; Manufacturer Part Number 1: TDYSFF-M3/10; Part Description: Screwed spacer sleeve; Int.thread: M3; 25mm; brass; Supplier 1: TME; Supplier Part Number 1: TDYSFF-M3/10
MECH26 MECH27 MECH36 MECH37 = STANDOFF_M-F_THREADED_M3x8x10mm_HEX_5mm dia: STANDOFF M/F MET 5MM HEX 10MM L; Manufacturer Part Number 1: 24313; Part Description: Hex Standoff Threaded M3 Brass 0.394" (10.00mm); Manufacturer: Keystone Electronics; Thread/Screw/Hole Size: M3 Thread; Plating: Nickel; Between Board Height: 0.394" (10.0mm); SCDType: undef; RoHS: RoHS Compliant; Description 1: STANDOFF M/F MET 5MM HEX 10MM L; Category: Hardware Fasteners Accessories; Stock 1: 240; Pricing 1: 10=0.969, 100=0.881, 500=0.58, 1000=0.3685, 2500=0.34215 (USD); Type: Hex Threaded, Male/Female; Size: 0.197" (5.0mm) Hex; Length - Overall: 0.709" (18.0mm); Material: Brass; Color: Natural; ComponentLink1URL: http://www.keyelco.com/pdfs/M55p67.pdf; ComponentLink1Description: http://www.keyelco.com/pdfs/M55p67.pdf; Supplier 1: Digi-Key; Supplier Part Number 1: 24313K-ND
MECH28-MECH35 = STANDOFF_M-F_THREADED_M3x8x10mm_HEX_5mm dia: STANDOFF M/F MET 5MM HEX 10MM L; Manufacturer: BOSSARD; Manufacturer Part Number 1: 1003755; Part Description: Screw; M3x6; DIN:912; Head: cheese head; imbus; steel; zinc; Supplier 1: TME; Supplier Part Number 1: 1003755
R477 R478 R483 R484 R489 R490 R495 R496 R501 R502 = Res_0402: as R419-R423 on sheet 27_BoardPowerSupply 1; Value: 0R; Supplier 1: Digi-Key; Supplier Part Number 1: 311-0.0JRTR-ND; Category: Resistors; Temperature Coefficient: -; Features: Moisture Resistant; Supplier Device Package: 0402; Height: 0.016" (0.40mm); Package / Case: 0402 (1005 Metric); Operating Temperature: -55°C ~ 155°C; Size / Dimension: 0.039" L x 0.020" W (1.00mm x 0.50mm); Composition: Thick Film; Packaging: Tape & Reel (TR); Number of Terminations: 2; RoHS: RoHS Compliant
R479 R480 R485 R486 R493 R494 = Res_0402: as R454 on sheet 28_BoardPowerSupply 2; Value: 10k, 1%; Supplier 1: Digi-Key; Supplier Part Number 1: 311-10.0KLRTR-ND; Resistance (Ohms): 10k; Packaging: Tape & Reel (TR); RoHS: RoHS Compliant; Package / Case: 0402 (1005 Metric); Tolerance: ±1%; Operating Temperature: -55°C ~ 155°C; Size / Dimension: 0.039" L x 0.020" W (1.00mm x 0.50mm); Number of Terminations: 2; Category: Resistors; Height: 0.016" (0.40mm); Supplier Device Package: 0402; Features: Moisture Resistant; Composition: Thick Film
R481 R482 R487 R488 R497 R498 = Res_0402: as R476 on sheet 28_BoardPowerSupply 2; Value: 8.2k, 1%; Supplier 1: Digi-Key; Supplier Device Package: 0402; Package / Case: 0402 (1005 Metric); Height: 0.016" (0.40mm); Supplier Part Number 1: 311-8.20KLRCT-ND; Number of Terminations: 2; Operating Temperature: -55°C ~ 155°C; Resistance (Ohms): 8.2k; Size / Dimension: 0.039" L x 0.020" W (1.00mm x 0.50mm); Composition: Thick Film; Category: Resistors; Tolerance: ±1%; Features: Moisture Resistant; RoHS: RoHS Compliant; Packaging: Cut Tape (CT)
R491 R492 = Res_0402: as R470 on sheet 28_BoardPowerSupply 2; Value: 7.5k, 1%; Operating Temperature: -55°C ~ 155°C; Height - Seated (Max): 0.016" (0.40mm); Supplier 1: Digi-Key; Composition: Thick Film; Packaging: Cut Tape (CT); Tolerance: ±1%; Category: Resistors; Part Status: Active; Failure Rate: -; Supplier Device Package: 0402; Features: Moisture Resistant; Supplier Part Number 1: YAG3512CT-ND; RoHS: RoHS Compliant; Package / Case: 0402 (1005 Metric); Size / Dimension: 0.039" L x 0.020" W (1.00mm x 0.50mm)
R499 R500 = Res_0402: as R459 on sheet 28_BoardPowerSupply 2; Value: 15k, 1%; Category: Resistors; Number of Terminations: 2; RoHS: RoHS Compliant; Features: Moisture Resistant; Operating Temperature: -55°C ~ 155°C; Tolerance: ±1%; Composition: Thick Film; Resistance (Ohms): 15k; Failure Rate: -; Height - Seated (Max): 0.016" (0.40mm); Packaging: Cut Tape (CT); Supplier Device Package: 0402; Size / Dimension: 0.039" L x 0.020" W (1.00mm x 0.50mm); Package / Case: 0402 (1005 Metric); Part Status: Active; Supplier 1: Digi-Key; Supplier Part Number 1: 311-15.0KLRCT-ND
R503 R504 = Res_0402: Manufacturer: Stackpole Electronics Inc; Manufacturer Part Number 1: RMCF0402FT1K00; Part Description: RES SMD 1K OHM 1% 1/16W 0402; Temperature Coefficient: ±100ppm/°C; Power (Watts): 0.063W, 1/16W; Value: 1k, 1%; Supplier 1: Digi-Key; Supplier Part Number 1: RMCF0402FT1K00TR-ND; Resistance (Ohms): 1k; Packaging: Tape & Reel (TR); Category: Resistors; RoHS: RoHS Compliant; Tolerance: ±1%; Height: 0.016" (0.40mm); Number of Terminations: 2; Package / Case: 0402 (1005 Metric); Operating Temperature: -55°C ~ 155°C; Features: -; Composition: Thick Film; Supplier Device Package: 0402; Size / Dimension: 0.039" L x 0.020" W (1.00mm x 0.50mm)
R505 R506 = Res_0402: Manufacturer: Panasonic Electronic Components; Part Description: RES SMD 100K OHM 5% 1/10W 0402; Manufacturer Part Number 1: ERJ-2GEJ104X; Power (Watts): 0.1W, 1/10W; Temperature Coefficient: ±200ppm/°C; Value: 100k, 5%; Supplier 1: Digi-Key; Supplier Part Number 1: P100KJTR-ND; Category: Resistors; Size / Dimension: 0.039" L x 0.020" W (1.00mm x 0.50mm); Supplier Device Package: 0402; Composition: Thick Film; Number of Terminations: 2; RoHS: RoHS Compliant; Height: 0.016" (0.40mm); Operating Temperature: -55°C ~ 155°C; Features: Automotive AEC-Q200; Tolerance: ±5%; Packaging: Tape & Reel (TR); Resistance (Ohms): 100k; Package / Case: 0402 (1005 Metric)
TP1-TP5 = TESTPOINT_THT_MINI: Test Point PCB mount Miniature White; Manufacturer Part Number 1: S1751-46R; Manufacturer: Harwin Inc; Part Description: Natural PC Test Point 0.128" x 0.065" x 0.079" (3.25mm x 1.65mm x 2.00mm) Brass, Tin Plating Surface Mount Mounting Type; Supplier 1: Digi-Key; Supplier Part Number 1: 952-1478-2-ND; RoHS: RoHS Compliant; Color: Natural; Material: Copper Alloy; Mounting Type: Surface Mount; Terminal: 0.128" x 0.065" x 0.079" (3.25mm x 1.65mm x 2.00mm) Brass, Tin Plated; Type: PC Test Point; Packaging: Tape & Reel (TR); Category: Test and Measurement